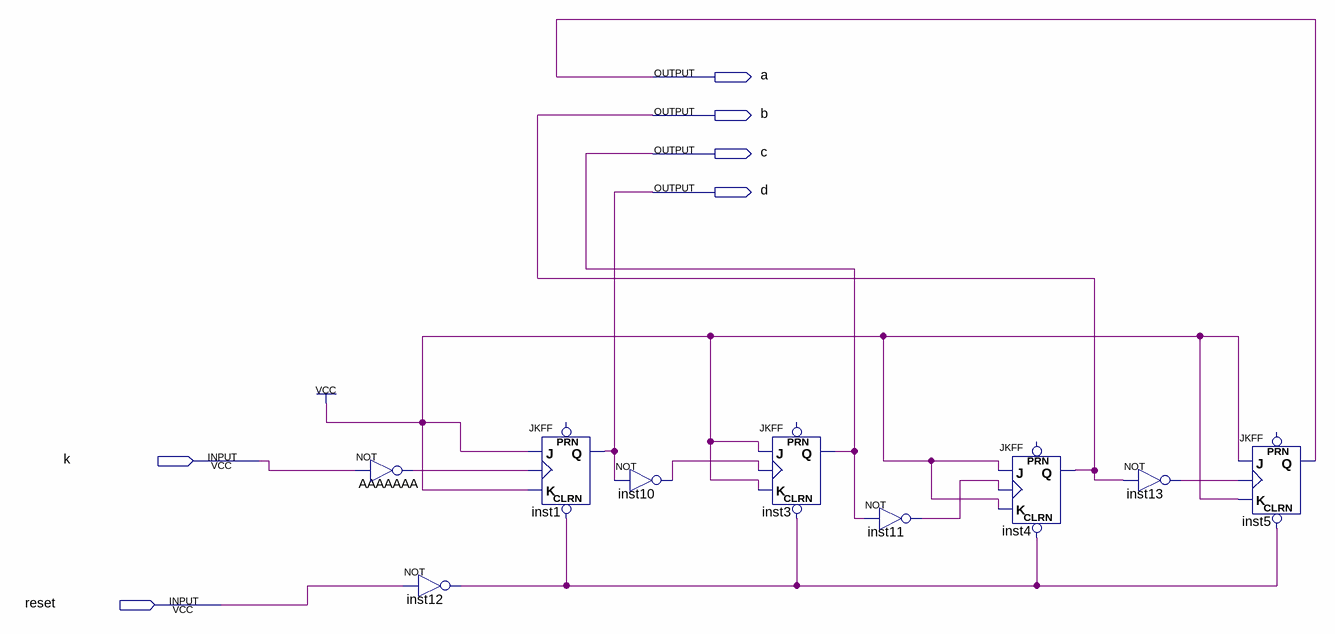
[diagram p0: schematic sheet]
// Quartus schematic contadorassinc.bdf as structural Verilog: 9 symbols, 6 pins
module contadorassinc (
  input  k,
  input  reset,
  output a,
  output b,
  output c,
  output d
);

  wire AAAAAAA_out, inst10_out, inst11_out, inst12_out, inst13_out;

  not AAAAAAA (AAAAAAA_out, k);
  not inst12 (inst12_out, reset);
  JKFF inst1 (.CLRN(inst12_out), .K(1'b1), .J(1'b1), .CLK(AAAAAAA_out), .Q(d));  // open: PRN
  not inst10 (inst10_out, d);
  JKFF inst3 (.CLRN(inst12_out), .K(1'b1), .J(1'b1), .CLK(inst10_out), .Q(c));  // open: PRN
  not inst11 (inst11_out, c);
  JKFF inst4 (.CLRN(inst12_out), .K(1'b1), .J(1'b1), .CLK(inst11_out), .Q(b));  // open: PRN
  not inst13 (inst13_out, b);
  JKFF inst5 (.CLRN(inst12_out), .K(1'b1), .J(1'b1), .CLK(inst13_out), .Q(a));  // open: PRN
endmodule
